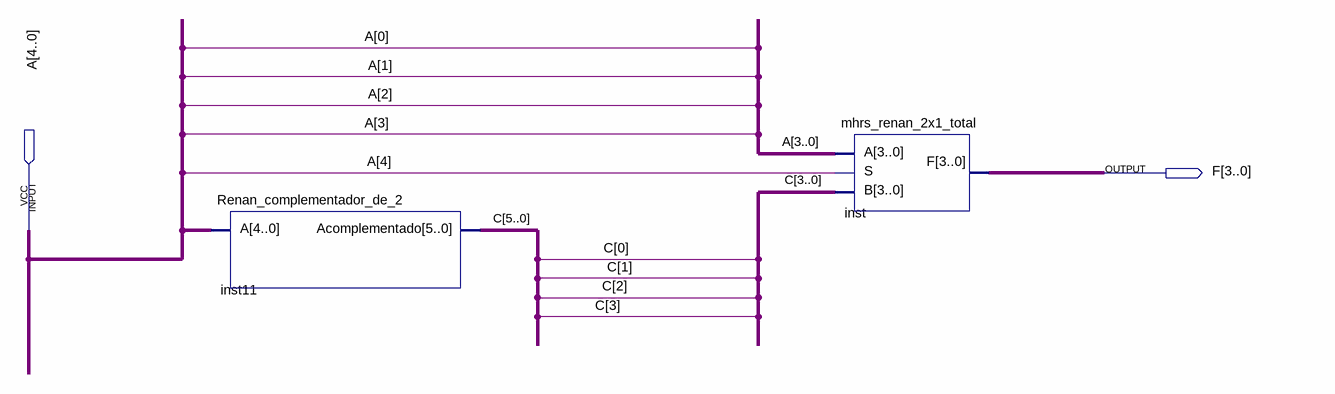
[diagram p0: schematic sheet]
// Quartus schematic mhrs_Selecionador_de_cmp2.bdf as structural Verilog: 2 symbols, 2 pins
module mhrs_Selecionador_de_cmp2 (
  input  [4:0] A,
  output [3:0] F
);

  wire [5:0] C;

  Renan_complementador_de_2 inst11 (.A(A), .Acomplementado(C));
  mhrs_renan_2x1_total inst (.B(C[3:0]), .A(A[3:0]), .S(A[4]), .F(F));
endmodule
